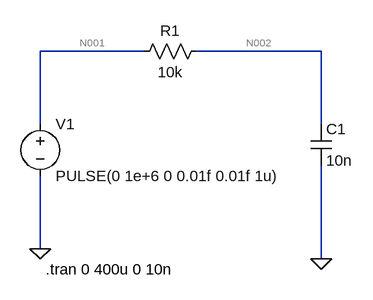
[diagram p0: schematic 4.asc]
4.asc, the LTspice schematic file:
Version 4
SHEET 1 1076 680
WIRE 448 112 288 112
WIRE 720 112 528 112
WIRE 288 224 288 112
WIRE 720 224 720 112
WIRE 288 416 288 304
WIRE 720 432 720 288
FLAG 288 416 0
FLAG 720 432 0
SYMBOL res 544 96 R90
WINDOW 0 0 56 VBottom 2
WINDOW 3 32 56 VTop 2
SYMATTR InstName R1
SYMATTR Value 10k
SYMBOL voltage 288 208 R0
WINDOW 123 0 0 Left 0
WINDOW 39 0 0 Left 0
SYMATTR InstName V1
SYMATTR Value PULSE(0 1e+6 0 0.01f 0.01f 1u)
SYMBOL cap 704 224 R0
SYMATTR InstName C1
SYMATTR Value 10n
TEXT 296 448 Left 2 !.tran 0 400u 0 10n

The netlist it stands for:
* 4.asc
R1 N002 N001 10k
V1 N001 0 PULSE(0 1e+6 0 0.01f 0.01f 1u)
C1 N002 0 10n
.tran 0 400u 0 10n
.backanno
.end

* Results of the author's LTspice run, read from the files saved beside the schematic
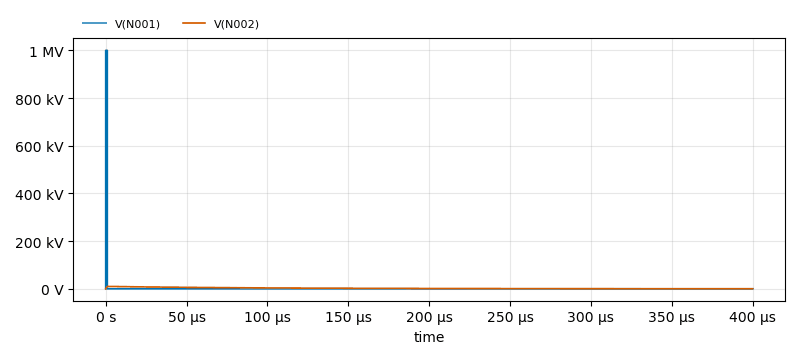
[diagram p1: Transient Analysis of 4.asc, plotted from the saved traces]
* Transient Analysis, 1 run:
*   V(N001): min 0 V, max 1 MV, average 2.512 kV, rms 50.12 kV, last 0 V
*   V(N002): min 0 V, max 9.998 kV, average 2.468 kV, rms 3.554 kV, last 185 V